# EAGLE design smoothieboard-glcd-adapter (EAGLE 6.6.0)
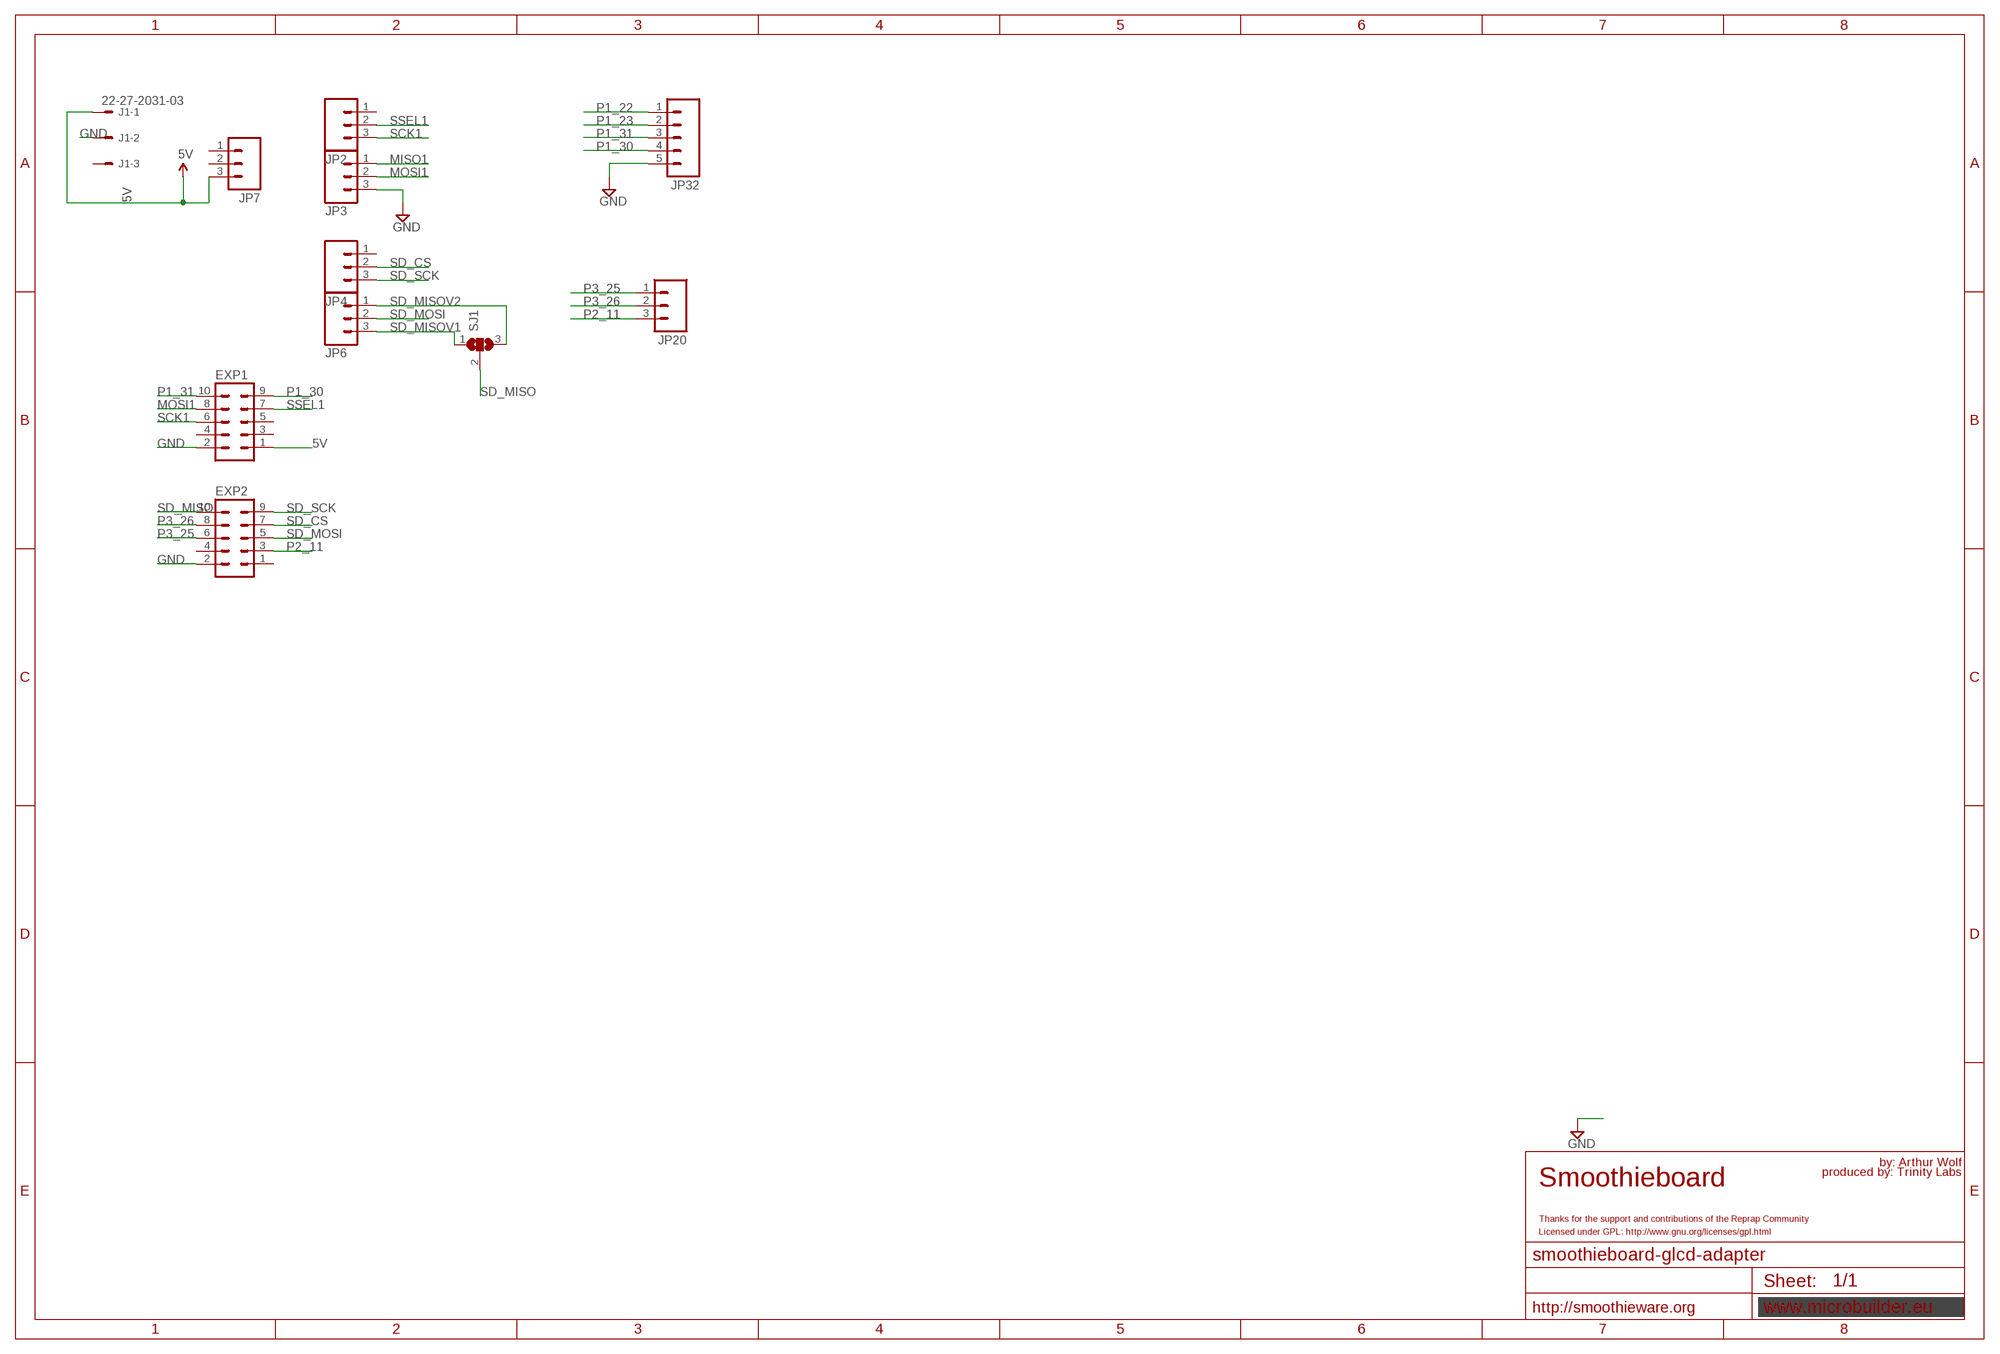
[diagram p0: schematic, sheet 1]

## Parts
EXP1  ML10  [ML10]
EXP2  ML10  [ML10]
J1  22-27-2031-03  [6410-03]
JP2  M031X03_NO_SILK  [1X03_NO_SILK]
JP3  M031X03_NO_SILK  [1X03_NO_SILK]
JP4  M031X03_NO_SILK  [1X03_NO_SILK]
JP6  M031X03_NO_SILK  [1X03_NO_SILK]
JP7  M03PTH  [1X03]
JP20  M03PTH  [1X03]
JP32  M05PTH  [1X05]
SJ1  SJ2W  [SJ_2]

## Nets
5V: EXP1.1 J1.1 JP7.3
GND: EXP1.2 EXP2.2 J1.2 JP3.3 JP32.5
MISO1: JP3.1
MOSI1: EXP1.8 JP3.2
P1_22: JP32.1
P1_23: JP32.2
P1_30: EXP1.9 JP32.4
P1_31: EXP1.10 JP32.3
P2_11: EXP2.3 JP20.3
P3_25: EXP2.6 JP20.1
P3_26: EXP2.8 JP20.2
SCK1: EXP1.6 JP2.3
SD_CS: EXP2.7 JP4.2
SD_MISO: EXP2.10 SJ1.2
SD_MISOV1: JP6.3 SJ1.1
SD_MISOV2: JP6.1 SJ1.3
SD_MOSI: EXP2.5 JP6.2
SD_SCK: EXP2.9 JP4.3
SSEL1: EXP1.7 JP2.2
Unconnected: EXP1.3 EXP1.4 EXP1.5 EXP2.1 EXP2.4 J1.3 JP2.1 JP4.1 JP7.1 JP7.2

## Notes on the sheet
- by: Arthur Wolf
- produced by: Trinity Labs
- Smoothieboard
- Thanks for the support and contributions of the Reprap Community
- Licensed under GPL: http://www.gnu.org/licenses/gpl.html
- http://smoothieware.org

## Library data of the parts
EXP1 EXP2 = con-harting-ml:ML10: HARTING; OC_FARNELL: unknown; OC_NEWARK: unknown
J1 = con-molex:22-?-03: CONNECTOR wire to board 2.54 mm (.1 inch) pitch header; OC_FARNELL: unknown; OC_NEWARK: unknown
JP2-JP4 JP6 JP7 JP20 = SparkFun:M03: Header 3 Standard 3-pin 0.1" header. Use with straight break away headers (SKU : PRT-00116), right angle break away headers (PRT-00553), swiss pins (PRT-00743), machine pins (PRT-00117), and female headers (PRT-00115). Molex polarized connector foot print use with SKU : PRT-08232 with associated crimp pins and housings.
JP32 = SparkFun:M05: Header 5 Standard 5-pin 0.1" header. Use with straight break away headers (SKU : PRT-00116), right angle break away headers (PRT-00553), swiss pins (PRT-00743), machine pins (PRT-00117), and female headers (PRT-00115). Molex polarized connector foot print use with SKU : PRT-08230 with associated crimp pins and housings.
SJ1 = jumper:SJ2W: SMD solder JUMPER

## Board
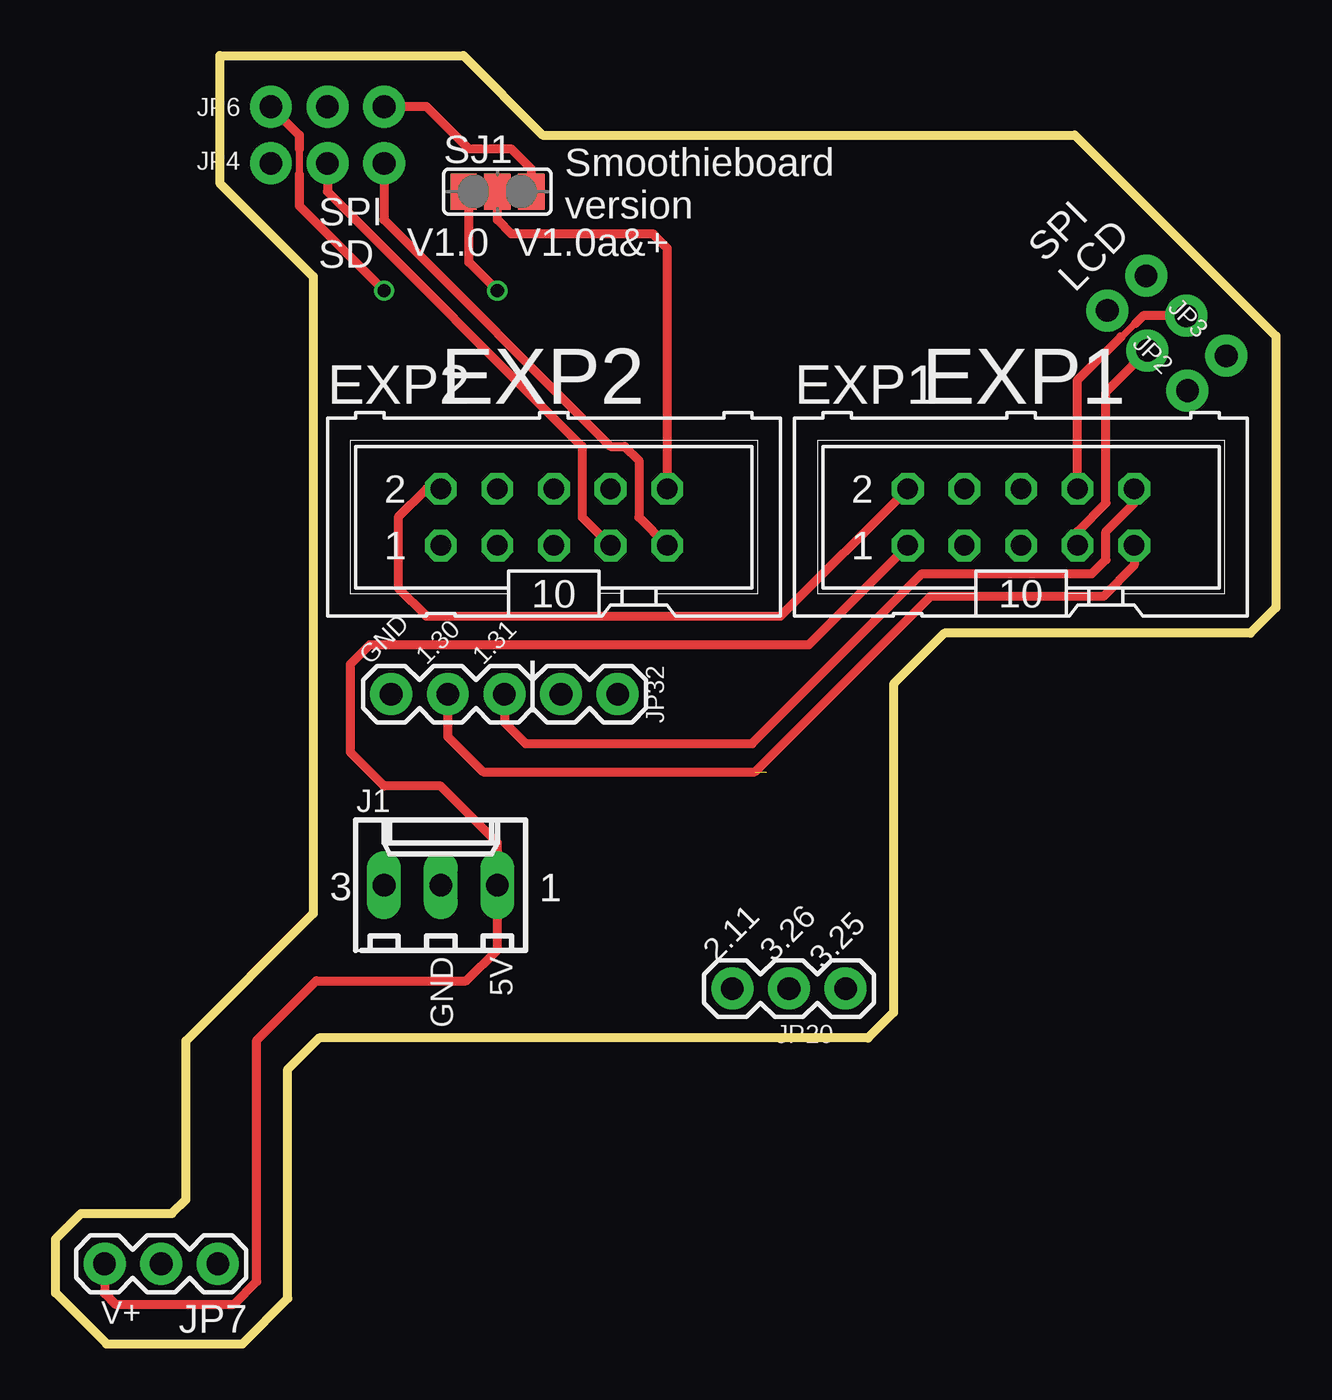
[diagram p1: board, top side]
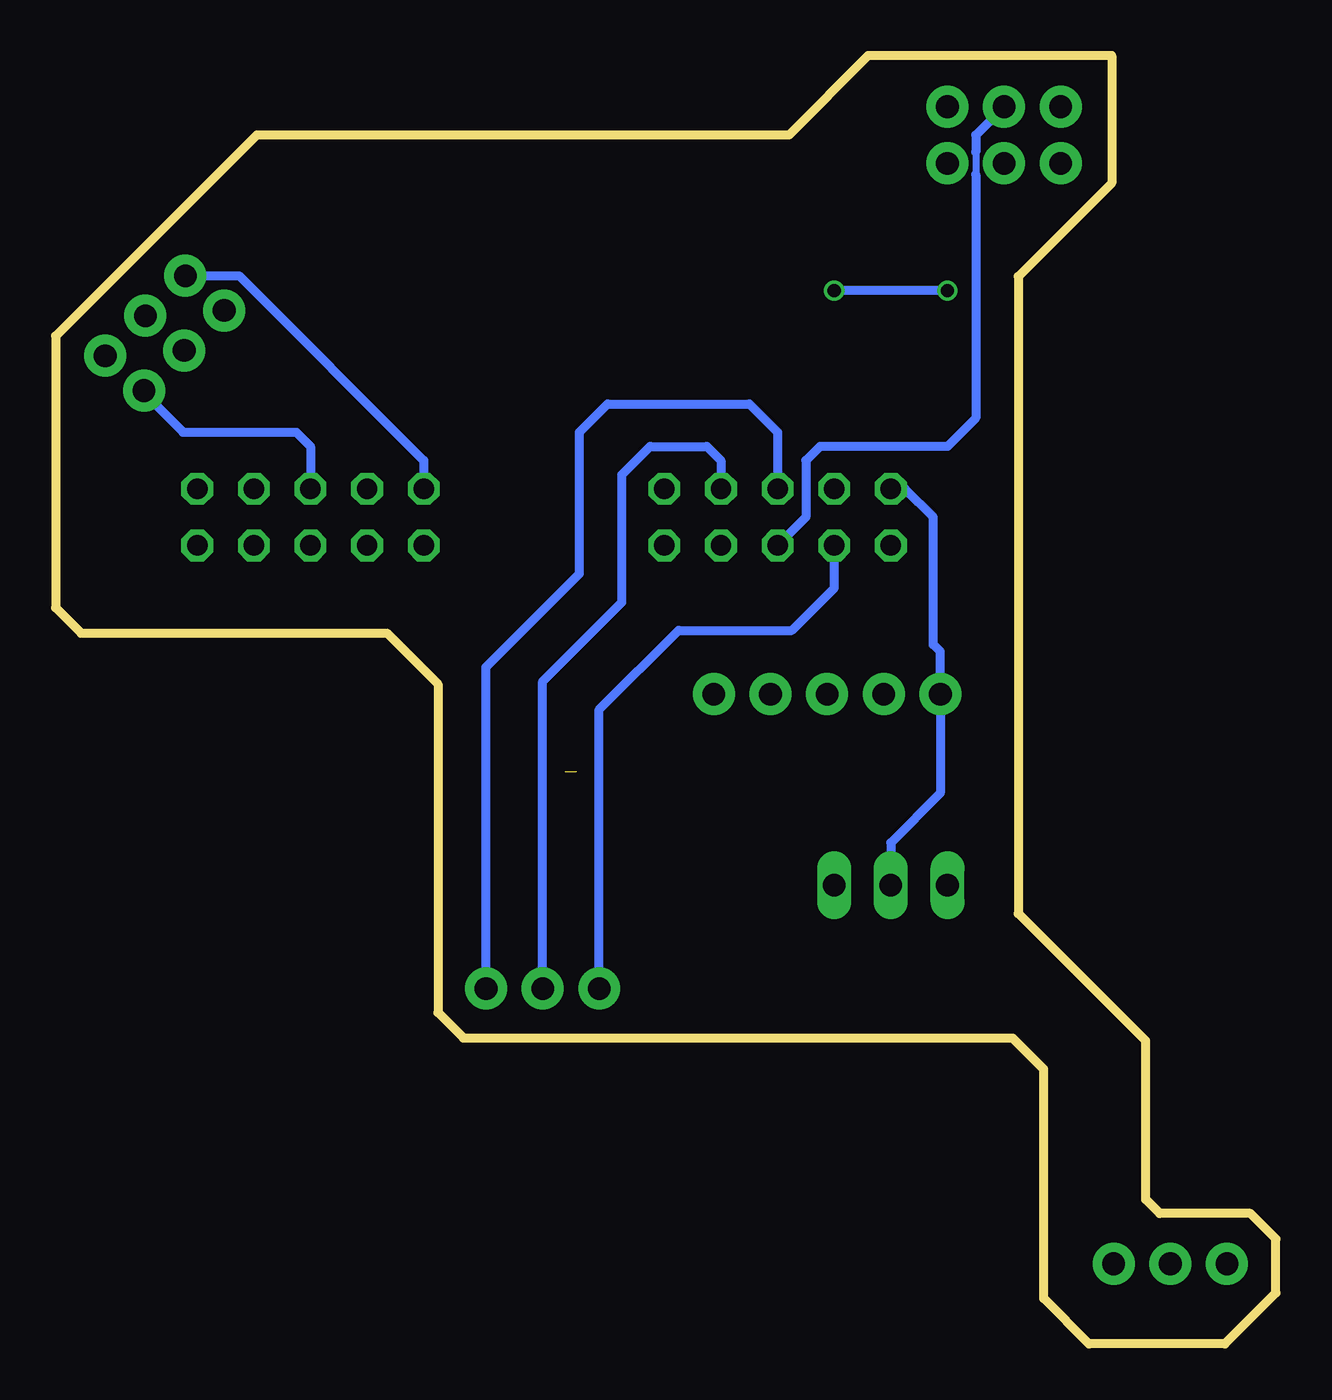
[diagram p2: board, bottom side, seen from below]

Size 54.74 x 57.78 mm. Coordinates in mm from the lower left corner, seen from the top.
Outline: 2.03,0.25 0.13,2.16
Outline: 21.84,54.23 45.72,54.23 54.74,45.21 54.74,33.02 53.59,31.88 39.88,31.88 37.59,29.59 37.59,14.86 36.45,13.72 11.81,13.72 10.41,12.32 10.41,2.03 8.38,0 2.29,0 0,2.29 0,4.7 1.14,5.84 5.21,5.84 5.84,6.48 5.84,13.59 11.56,19.3 11.56,47.88 7.37,52.07 7.37,57.78 18.29,57.78 21.84,54.23
Copper layers (1*16): Top 0.035mm / dielectric 1.5mm / Bottom 0.035mm
Design rules "dirt_cheap_dirty_boards.v1": minimum track width 5mil, minimum drill 12mil, track to track 5mil, track to pad 5mil, pad to pad 5mil, via to via 5mil, smd to smd 0mil, copper to edge 10mil, drill to drill 10mil, minimum pad ring 10mil, minimum via ring 6mil, stop-mask expansion 2mil, vias tented up to drill 25mil, thermal gap 10mil

### Footprints (pad centres in the part's own frame; a part is rotated, then mirrored left to right if it is on the bottom)
ML10 = drill 0.914 octagon: 1 -5.08,-1.27; 2 -5.08,1.27; 3 -2.54,-1.27; 4 -2.54,1.27; 5 0,-1.27; 6 0,1.27; 7 2.54,-1.27; 8 2.54,1.27; 9 5.08,-1.27; 10 5.08,1.27
6410-03 = drill 1.016 long: 1 2.54,0; 2 0,0; 3 -2.54,0
1X03_NO_SILK = drill 1.016 pad 1.88: 1 0,0; 2 2.54,0; 3 5.08,0
1X03 = drill 1.016 pad 1.88: 1 0,0; 2 2.54,0; 3 5.08,0
1X05 = drill 1.016 pad 1.88: 1 0,0; 2 2.54,0; 3 5.08,0; 4 7.62,0; 5 10.16,0
SJ_2 = smd 1.168 x 1.6: 1 -1.524,0; 2 0,0; 3 1.524,0

### Placement (x,y rotation side)
EXP1  43.31,37.08 0 top
EXP2  22.35,37.08 0 top
J1  17.27,20.57 0 top
JP2  47.18,46.35 315 top
JP3  52.51,44.32 135 top
JP4  9.65,52.96 0 top
JP6  14.73,55.5 180 top
JP7  7.27,3.59 180 top
JP20  35.43,15.94 180 top
JP32  25.21,29.15 180 top
SJ1  19.81,51.69 0 top

### Tracks (layer width: path | path; a pad name or v marks a point on that pad's centre or on a via)
5V
  Top 0.406: EXP1.1 33.78,31.37 14.1,31.37 13.21,30.48 13.21,26.54 14.73,25.02 17.27,25.02 19.81,22.48 J1.1 19.81,17.68 18.41,16.28 11.68,16.28 9.02,13.61 9.02,2.79 8,1.78 2.67,1.78 2.19,2.25 JP7.3
GND
  Top 0.406: EXP2.2 16.64,38.35 15.37,37.08 15.37,33.91 16.64,32.64 32.51,32.64 EXP1.2
  Bottom 0.406: JP3.3 46.52,47.92 38.23,39.62 EXP1.2 | J1.2 17.27,22.48 15.05,24.7 JP32.5 15.05,31.05 15.37,31.37 15.37,37.08 16.64,38.35 EXP2.2
MOSI1
  Top 0.305: 48.44,45.77 48.41,45.77 47.8,45.16
  Top 0.406: JP3.2 48.79,46.12 48.44,45.77 | 47.8,45.16 47.78,45.16 45.82,43.21 45.82,38.38 EXP1.8
P1_30  (1 unrouted)
  Top 0.406: JP32.4 17.59,27.24 19.18,25.65 31.37,25.65 39.24,33.53 46.99,33.53 48.39,34.92 EXP1.9
P1_31
  Top 0.406: JP32.3 20.13,27.88 21.08,26.92 31.24,26.92 38.86,34.54 46.48,34.54 47.12,35.18 47.12,36.45 48.39,37.72 EXP1.10
P2_11
  Bottom 0.406: JP20.3 30.35,28.45 26.8,32 21.72,32 19.81,33.91 EXP2.3
P3_25
  Bottom 0.406: JP20.1 35.43,30.35 31.24,34.54 31.24,40.89 29.97,42.16 23.62,42.16 22.35,40.89 EXP2.6
P3_26
  Bottom 0.406: JP20.2 32.89,29.72 29.34,33.27 29.34,38.99 28.07,40.26 25.53,40.26 24.89,39.62 EXP2.8 24.89,38.99
SCK1
  Bottom 0.406: JP2.3 50.77,42.64 49.02,40.89 43.94,40.89 43.31,40.26 EXP1.6
SD_CS
  Top 0.406: JP4.2 12.19,51.69 23.62,40.26 23.62,37.08 EXP2.7
SD_MISO
  Top 0.406: EXP2.10 27.43,49.15 26.8,49.78 20.45,49.78 19.81,50.42 SJ1.2
SD_MISOV1  (via drill 0.6)
  Top 0.305: 10.92,53.59 10.92,52.45
  Top 0.406: 18.54,51.69 SJ1.1 18.54,51.43 18.54,48.51 v19.81,47.24 | JP6.3 10.92,54.23 10.92,53.59 | v14.73,47.24 10.92,51.05 10.92,52.45
  Bottom 0.406: v14.73,47.24 v19.81,47.24
SD_MISOV2
  Top 0.406: SJ1.3 21.34,52.7 20.45,53.59 18.54,53.59 16.64,55.5 JP6.1
SD_MOSI
  Bottom 0.305: 13.46,53.47 13.46,52.45
  Bottom 0.406: JP6.2 13.46,54.23 13.46,53.47 | EXP2.5 21.08,37.08 21.08,39.62 20.45,40.26 14.73,40.26 13.46,41.53 13.46,52.45
SD_SCK
  Top 0.406: JP4.3 14.73,50.42 24.89,40.26 25.53,40.26 26.16,39.62 26.16,37.08 EXP2.9
SSEL1
  Top 0.406: EXP1.7 45.85,36.45 47.12,37.72 47.12,42.7 JP2.2

### Text on the board
_tsilk: Smoothieboard / version | SPI / SD | V1.0 | V1.0a&+ | SPI / LCD | EXP2 | EXP1 | GND | 1.30 | 1.31 | | | GND | 5V | 2.11 | 3.26 | 3.25 | V+
_bsilk: 3.3v
_tNames: JP6 | JP6 | JP4 | JP4 | SJ1 | SJ1 | JP3 | JP3 | JP2 | JP2 | EXP2 | EXP2 | EXP1 | EXP1 | JP32 | JP32 | J1 | J1 | JP20 | JP20 | JP7 | JP7